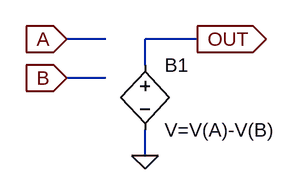
[diagram p0: schematic sub.asc]
sub.asc, the LTspice schematic file:
Version 4
SHEET 1 880 680
WIRE 64 192 16 192
WIRE 64 240 16 240
WIRE 112 224 112 192
WIRE 112 336 112 304
WIRE 176 192 112 192
FLAG 16 192 A
IOPIN 16 192 In
FLAG 16 240 B
IOPIN 16 240 In
FLAG 176 192 OUT
IOPIN 176 192 Out
FLAG 112 336 0
SYMBOL bv 112 208 R0
SYMATTR InstName B1
SYMATTR Value V=V(A)-V(B)

The netlist it stands for:
* sub.asc
B1 OUT 0 V=V(A)-V(B)
.backanno
.end